# EAGLE design metal_detector_circuit (EAGLE 7.4.0)
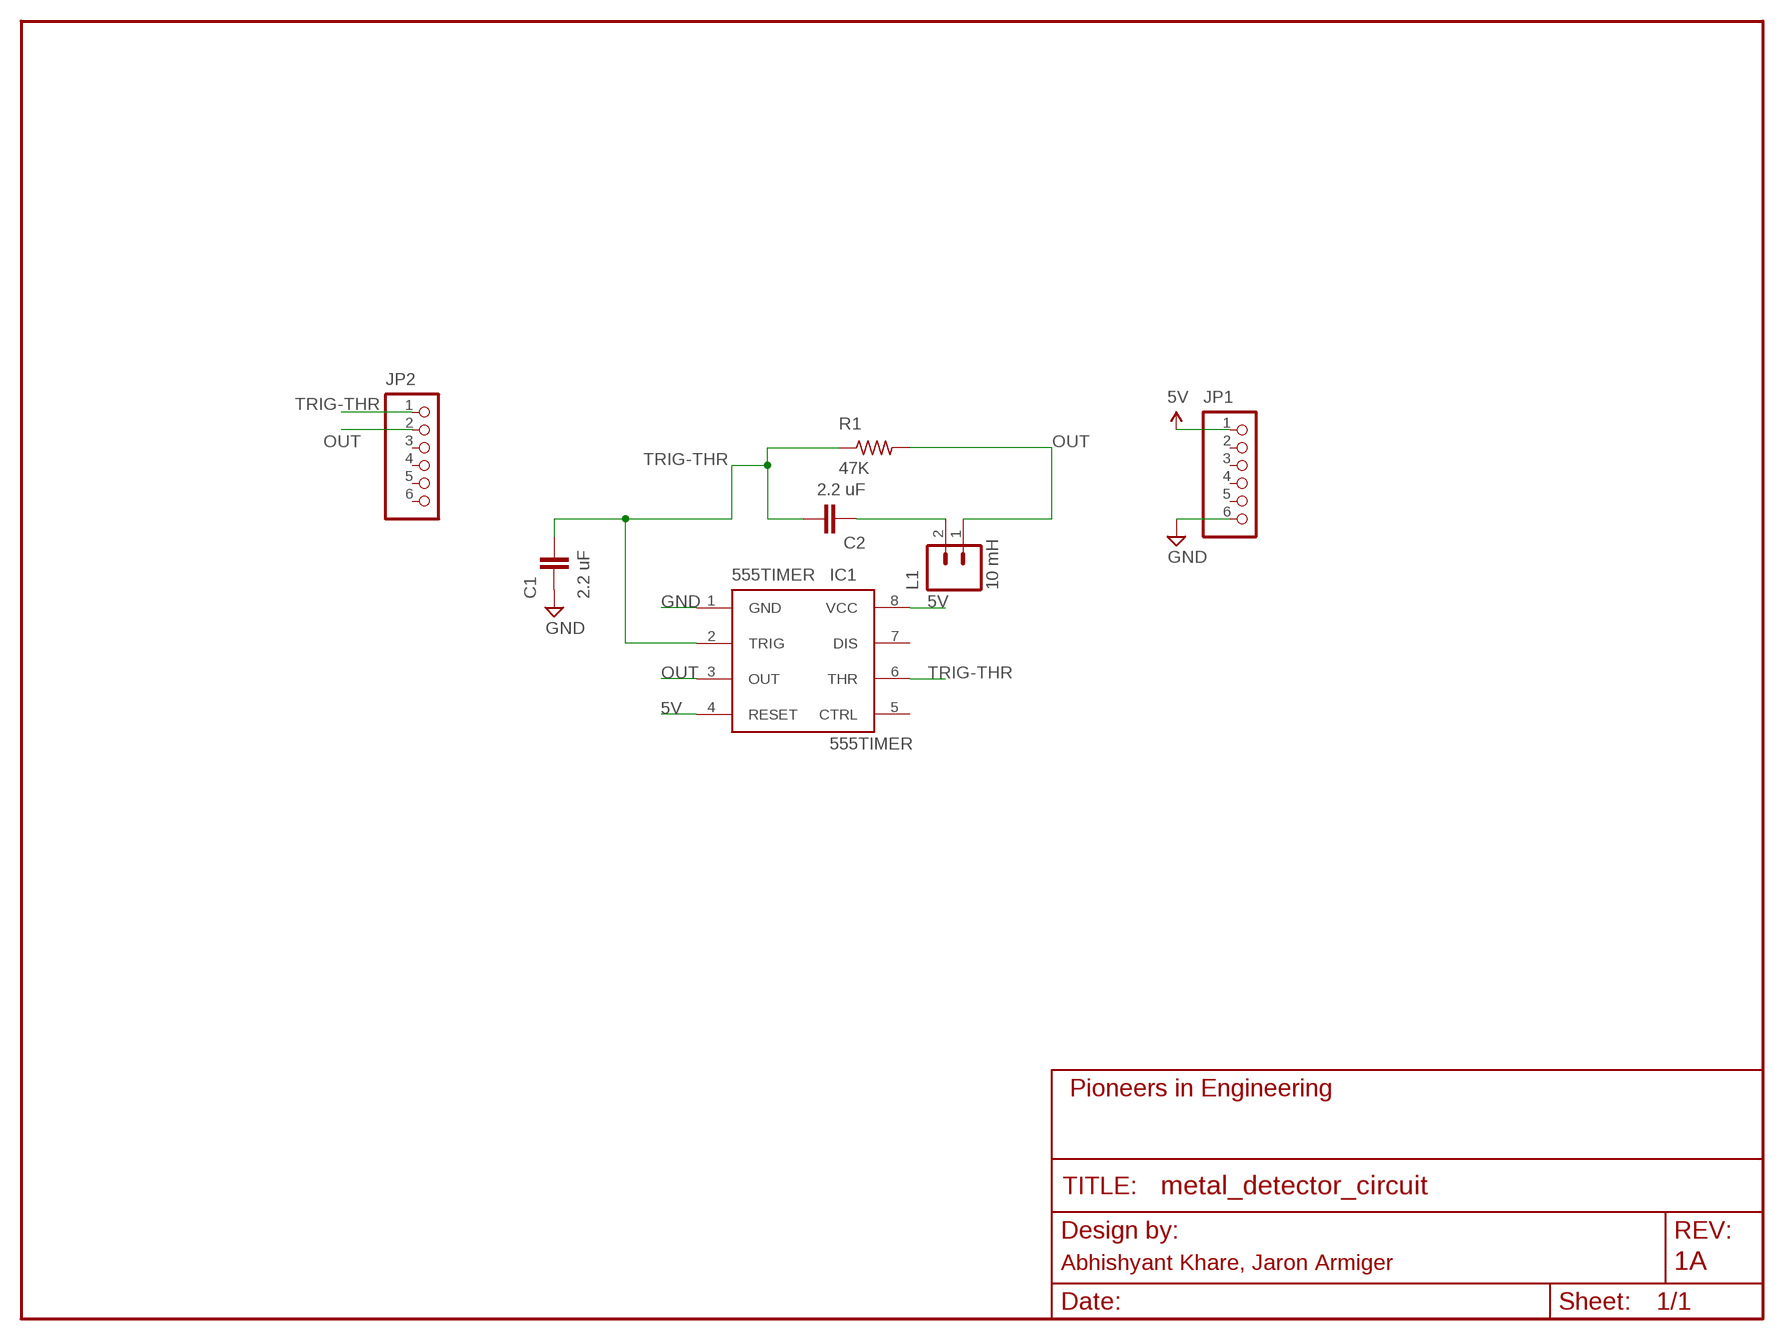
[diagram p0: schematic, sheet 1]
FRAME1 (FRAME-LETTER): AUTHOR: Abhishyant Khare, Jaron Armiger; REVISION: 1A

## Parts
C1  2.2 uF  CAP0603-CAP  [0603-CAP]
C2  2.2 uF  CAP0603-CAP  [0603-CAP]
IC1  555TIMER  [8-PIN_SOIC]
JP1  PINHD-1X6  [1X06]
JP2  PINHD-1X6  [1X06]
L1  10 mH  M02PTH  [1X02]
R1  47K  R-US_R0603  [R0603]

## Nets
5V: IC1.4(RESET) IC1.8(VCC) JP1.1
GND: C1.1 IC1.1(GND) JP1.6
N$2: C2.1 L1.2
OUT: IC1.3(OUT) JP2.2 L1.1 R1.2
TRIG-THR: C1.2 C2.2 IC1.2(TRIG) IC1.6(THR) JP2.1 R1.1
Unconnected: IC1.5(CTRL) IC1.7(DIS) JP1.2 JP1.3 JP1.4 JP1.5 JP2.3 JP2.4 JP2.5 JP2.6

## Library data of the parts
C1 C2 = pie:CAP: Capacitor Standard 0603 ceramic capacitor, and 0.1" leaded capacitor.; PIE-INT-REF-NUM: CAPACITOR-GENERIC
IC1 = pie:555TIMER
JP1 JP2 = pie:PINHD-1X6: 6-pin 0.1-inch header; PARTNUMBER: 965
L1 = pie:M02: 2-pin 0.1-inch header and MTA connector; PIE-INT-REF-NUM: BULK-STOCK
R1 = pie:R-US_: RESISTOR, American symbol; PIE-INT-REF-NUM: RESISTOR-GENERIC

## Board
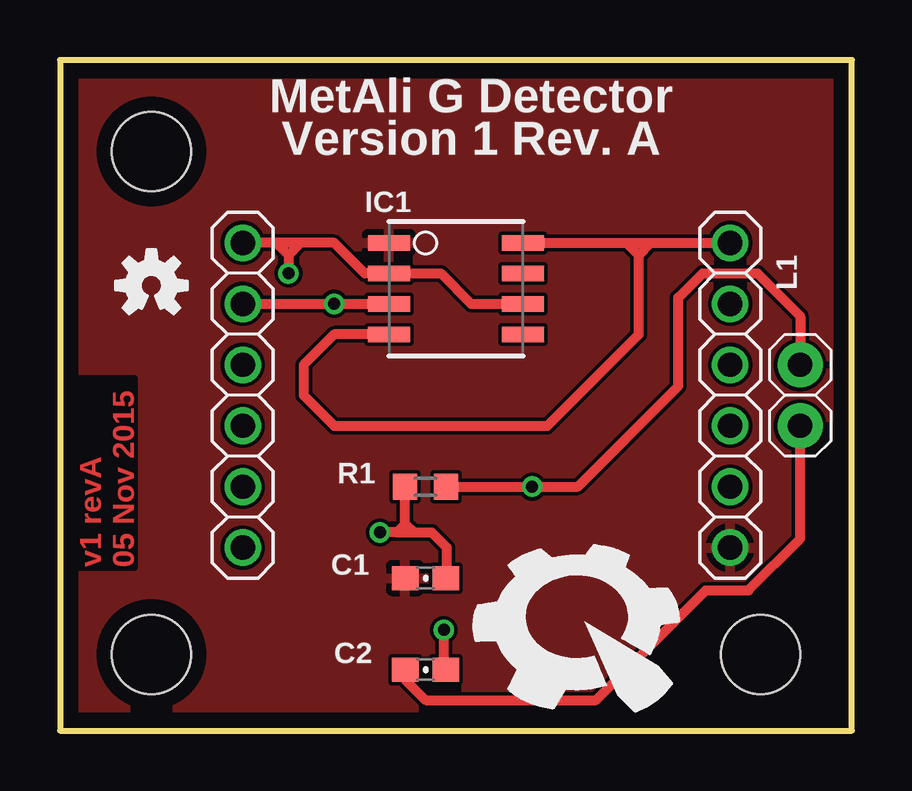
[diagram p1: board, top side]
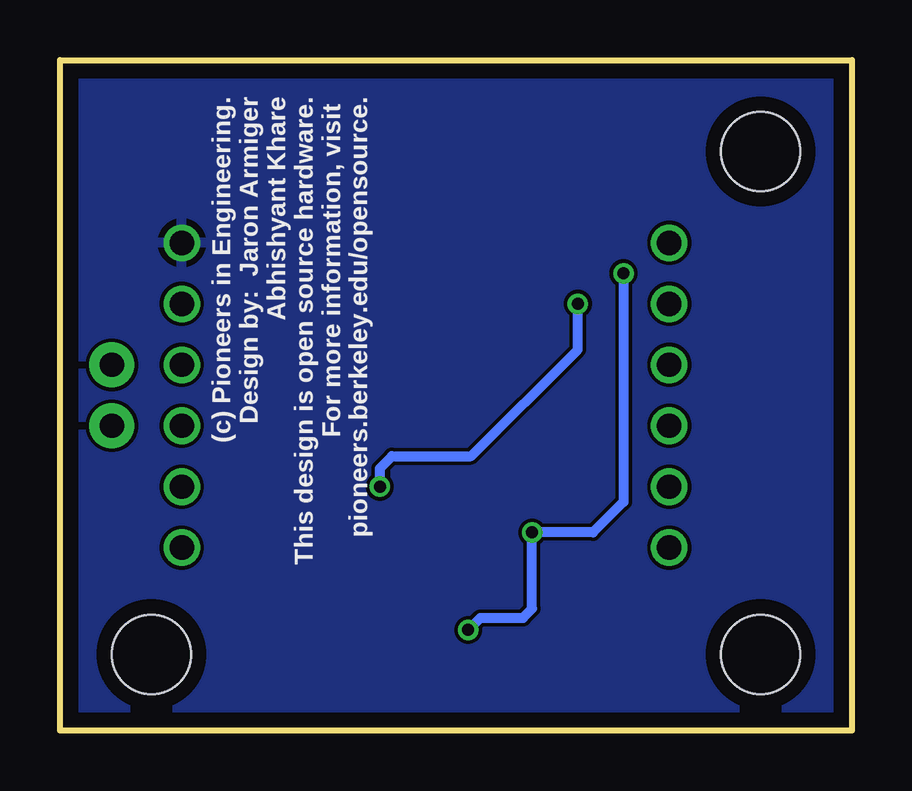
[diagram p2: board, bottom side, seen from below]

Size 33.02 x 27.94 mm. Coordinates in mm from the lower left corner, seen from the top.
Outline: 0,0 33.02,0 33.02,27.94 0,27.94 0,0
Copper layers (1*16): Top 2mil / dielectric 9mil / Bottom 2mil
Design rules "advancedcircuits-33each-pie": minimum track width 6mil, minimum drill 15mil, track to track 6mil, track to pad 6mil, pad to pad 6mil, via to via 6mil, smd to smd 6mil, copper to edge 25mil, drill to drill 7mil, minimum pad ring 7mil, minimum via ring 7mil, stop-mask expansion 3mil, vias tented up to drill 21mil, thermal gap 10mil

### Footprints (pad centres in the part's own frame; a part is rotated, then mirrored left to right if it is on the bottom)
0603-CAP = smd 1.1 x 1: 1 -0.85,0; 2 0.85,0
8-PIN_SOIC = smd 1.75 x 0.65: 1 -2.8,1.905; 2 -2.8,0.635; 3 -2.8,-0.635; 4 -2.8,-1.905; 5 2.8,-1.905; 6 2.8,-0.635; 7 2.8,0.635; 8 2.8,1.905
1X06 = drill 1.016 pad 1.524: 1 -6.35,0; 2 -3.81,0; 3 -1.27,0; 4 1.27,0; 5 3.81,0; 6 6.35,0
1X02 = drill 1.016 pad 1.88: 1 -1.27,0; 2 1.27,0
R0603 = smd 1 x 1.1: 1 -0.85,0; 2 0.85,0
STAND-OFF = hole 3.302: 0,0

### Placement (x,y rotation side)
C1  15.24,6.35 0 top
C2  15.24,2.54 0 top
IC1  16.51,18.41 0 top
JP1  27.94,13.97 270 top
JP2  7.62,13.97 270 top
L1  30.86,13.97 270 top
R1  15.24,10.16 0 top
U$1  [PIE-LOGO-SMALL]  21.84,4.57 0 top
U$2  [STAND-OFF]  3.81,24.13 0 top
U$4  [STAND-OFF]  3.81,3.17 0 top
U$7  [OSHW-LOGO-S]  3.81,18.54 0 top
U$17  [STAND-OFF]  29.21,3.17 0 top

### Tracks (layer width: path | path; a pad name or v marks a point on that pad's centre or on a via)
5V
  Top 0.406: IC1.4 11.43,16.51 10.16,15.24 10.16,13.97 11.43,12.7 20.32,12.7 24.13,16.51 24.13,19.81 | IC1.8 24.64,20.32 | 24.64,20.32 JP1.1 | 24.13,19.81 24.64,20.32 | 24.13,19.81 23.75,20.19
  pour Bottom: 0,0 0,27.94 33.02,27.94 33.02,0
GND
  pour Top: 0,0 0,27.94 33.02,27.94 33.02,0
N$2
  Top 0.406: C2.1 14.39,2.12 15.24,1.27 22.35,1.27 26.92,5.84 28.7,5.84 30.86,8 L1.2
OUT  (via drill 0.5)
  Top 0.406: JP2.2 v11.43,17.78 IC1.3 | 16,10.25 R1.2 v19.68,10.16 21.59,10.16 25.78,14.35 25.78,18.03 26.8,19.05 29.08,19.05 30.86,17.27 L1.1
  Bottom 0.406: v19.68,10.16 19.68,10.92 19.18,11.43 15.88,11.43 11.43,15.88 v11.43,17.78
TRIG-THR  (via drill 0.5)
  Top 0.406: C1.2 16.13,6.39 16.13,7.62 15.49,8.26 14.73,8.26 | 14.39,8.6 R1.1 | 10.03,20.32 11.43,20.32 12.7,19.05 IC1.2 15.88,19.05 17.14,17.78 IC1.6 | C2.2 16,2.63 v16,4.19 | 9.53,19.81 10.03,20.32 | 9.53,19.81 9.02,20.32 | 9.02,20.32 JP2.1 | 10.03,20.32 9.02,20.32 | 9.53,19.81 v9.53,19.05 | 14.39,8.6 14.73,8.26 | 14.39,8.6 14.05,8.26 | 14.05,8.26 v13.34,8.26 | 14.05,8.26 14.73,8.26
  Bottom 0.406: v9.53,19.05 9.53,9.53 10.79,8.26 v13.34,8.26 13.34,5.08 13.72,4.7 15.49,4.7 v16,4.19

### Text on the board
Top: v1 revA / 05 Nov 2015
tPlace: MetAli G Detector / Version 1 Rev. A
bPlace: (c) Pioneers in Engineering. / Design by: Jaron Armiger / Abhishyant Khare / This design is open source hardware. / For more information, visit / pioneers.berkeley.edu/opensource.